# Altium schematic sheet WROOM32.SchDoc: param:Title
size A4; Author: param.Autor; Version: param:Version
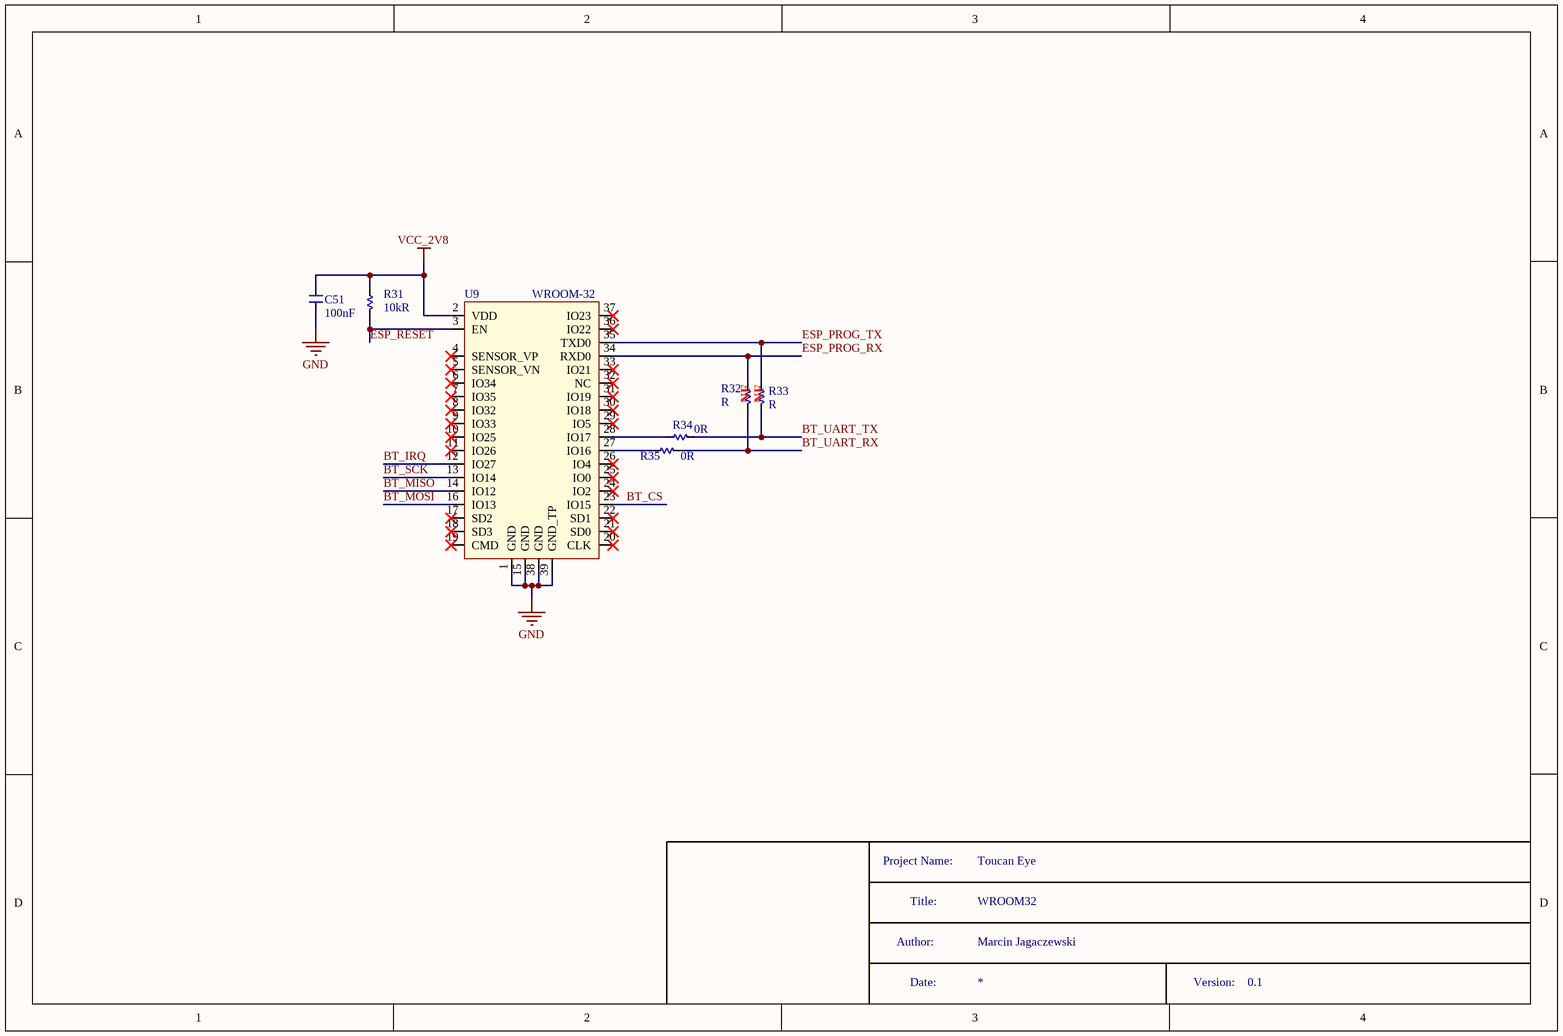
[diagram p0: WROOM32.SchDoc]

## Parts
C51  Capacitance: 100nF  [C_0201]  (hidden comment: C0201_100n_GRM033R6YA104KE14D)
R31  Resistance: 10kR  [R_0201]  (hidden comment: R0201_10k_ERJ-1GNF1002C)
R32  value R  [R_0201_NF]  (hidden comment: (NDI)0201)  (no BOM)
R33  value R  [R_0201_NF]  (hidden comment: (NDI)0201)  (no BOM)
R34  Resistance: 0R  [R_0201]  (hidden comment: R0201_0_ERJ-1GN0R00C)
R35  Resistance: 0R  [R_0201]  (hidden comment: R0201_0_ERJ-1GN0R00C)
U9  WROOM-32  [WROOM-32]

## Nets
GND: C51.1 U9.1(GND) U9.15(GND) U9.38(GND) U9.39(GND_TP)
VCC_2V8: C51.2 R31.2 U9.2(VDD)
BT_CS: U9.23(IO15)
BT_IRQ: U9.12(IO27)
BT_MISO: U9.14(IO12)
BT_MOSI: U9.16(IO13)
BT_SCK: U9.13(IO14)
BT_UART_RX: R32.1 R35.1
BT_UART_TX: R33.1 R34.1
ESP_PROG_RX: R32.2 U9.34(RXD0)
ESP_PROG_TX: R33.2 U9.35(TXD0)
ESP_RESET: R31.1 U9.3(EN)
NetR34_2: R34.2 U9.28(IO17)
NetR35_2: R35.2 U9.27(IO16)

Not connected (* = marked no-connect by the designer): U9 4(SENSOR_VP)* 5(SENSOR_VN)* 6(IO34)* 7(IO35)* 8(IO32)* 9(IO33)* 10(IO25)* 11(IO26)* 17(SD2)* 18(SD3)* 19(CMD)* 20(CLK)* 21(SD0)* 22(SD1)* 24(IO2)* 25(IO0)* 26(IO4)* 29(IO5)* 30(IO18)* 31(IO19)* 32(NC)* 33(IO21)* 36(IO22)* 37(IO23)*

## Notes on the sheet
- Project Name:
- Title:
- WROOM32
- Toucan Eye
- Author:
- Date:
- Marcin Jagaczewski
- Version:
- 0.1
- (in symbol (NDI)0201) NF

## Library data of the parts
C51 = C0201_100n_GRM033R6YA104KE14D: Multilayer Ceramic Capacitors MLCC - SMD/SMT 0201 0.10uF 35volts *Derate Voltage/Temp; Manufacturer: Murata; Tolerance: 10%; Dielectric: X5R; Voltage Rating (DC): 35V; Supplier 1: Mouser; Manufacturer Part Number: GRM033R6YA104KE14D; Stock 1: 295799; Pricing 1: 1=0.1, 10=0.061, 50=0.061, 100=0.027, 1000=0.015, 10000=0.01 (USD); Mount: Surface Mount; Case/Package: 0201; Weight: 1.2E-05oz; Case Code (Metric): 0603; Case Code (Imperial): 0201; Min Operating Temperature: -55°C; Max Operating Temperature: 85°C; Packaging: Tape and Reel; Voltage Rating: 35V; Termination: SMD/SMT; Package Quantity: 15000; Length: 0.024inch; Height: 0.3mm; Width: 0.3mm; Thickness: 0.013inch; ComponentLink1URL: http://www.mouser.com/ds/2/281/c02e-2905.pdf; ComponentLink1Description: http://www.mouser.com/ds/2/281/c02e-2905.pdf; ComponentLink2URL: http://search.murata.co.jp/Ceramy/image/img/A01X/partnumbering_e_01.pdf; ComponentLink2Description: http://search.murata.co.jp/Ceramy/image/img/A01X/partnumbering_e_01.pdf; *SCHChecked: *; *PCBChecked: *; Supplier Part Number 1: 81-GRM33R6YA104KE14D
R31 = R0201_10k_ERJ-1GNF1002C: RESISTOR, 0201, 0.05W, 1%, 10K; Manufacturer: Panasonic ECG; Temperature Coefficient: 200ppm/°C; Power Rating: 50mW; Voltage Rating: 25V; *SCHChecked: 1; Supplier 1: Mouser; Manufacturer Part Number: ERJ-1GNF1002C; Stock 1: 896102; Pricing 1: 1=0.49, 10=0.045, 50=0.045, 100=0.018, 1000=0.013, 10000=0.007 (USD); Mount: Surface Mount; Case/Package: 0201; Number of Pins: 2; Contact Plating: Tin,Matte; Case Code (Metric): 0603; Case Code (Imperial): 0201; Min Operating Temperature: -55°C; Max Operating Temperature: 125°C; Tolerance: 1%; Composition: Thick Film; Packaging: Tape and Reel; Package Quantity: 15000; Number of Terminations: 2; Military Standard: Not; Max Power Dissipation: 50mW; Voltage Rating (DC): 25V; Length: 0.6mm; Height: 0.01inch; Width: 0.012inch; Depth: 0.3mm; Radiation Hardening: No; REACH SVHC: Unknown; Lead Free: Lead Free; ComponentLink1URL: https://datasheet.ciiva.com/16508/aoa0000ce2-16508478.pdf; ComponentLink1Description: https://datasheet.ciiva.com/16508/aoa0000ce2-16508478.pdf; ComponentLink2URL: https://datasheet.ciiva.com/28514/1678782-28514095.pdf; ComponentLink2Description: https://datasheet.ciiva.com/28514/1678782-28514095.pdf; ComponentLink3URL: https://datasheet.ciiva.com/28514/1678782-28514085.pdf; ComponentLink3Description: https://datasheet.ciiva.com/28514/1678782-28514085.pdf; ComponentLink4URL: https://datasheet.ciiva.com/43467/1678782-43467078.pdf; ComponentLink4Description: https://datasheet.ciiva.com/43467/1678782-43467078.pdf; *PCBChecked: 1; Supplier Part Number 1: 667-ERJ-1GNF1002C
R34 R35 = R0201_0_ERJ-1GN0R00C: RES SMD 0.0OHM JUMPER 1/20W 0201; Manufacturer: Panasonic; Power Rating: 50mW; Tolerance: 1%; Voltage Rating: 25V; Temperature Coefficient: 600ppm/°C; *PCBChecked: 1; Supplier 1: Mouser; Manufacturer Part Number: ERJ-1GN0R00C; Stock 1: 835293; Pricing 1: 1=0.21, 10=0.02, 50=0.02, 100=0.008, 1000=0.005, 10000=0.003 (USD); Mount: Surface Mount; Case/Package: 0201; Case Code (Imperial): 0201; Case Code (Metric): 0603; Contact Plating: Tin; Min Operating Temperature: -55°C; Max Operating Temperature: 125°C; Packaging: Tape and Reel; Package Quantity: 15000; Composition: Thick Film; Military Standard: Not; Voltage Rating (DC): 25V; Length: 0.6mm; Height: 0.23mm; Width: 0.3mm; Depth: 0.3mm; REACH SVHC: Unknown; Lead Free: Lead Free; ComponentLink1URL: https://datasheet.ciiva.com/22730/1678796-22730749.pdf; ComponentLink1Description: https://datasheet.ciiva.com/22730/1678796-22730749.pdf; *SCHChecked: 1; Supplier Part Number 1: 667-ERJ-1GN0R00C
U9 = WROOM-32: *SCHChecked: 1; *PCBChecked: 1; Name: WROOM-32
R32 R33 = (NDI)0201: *SCHChecked: *; *PCBChecked: *